# Altium project N-FPGA.PrjPcb
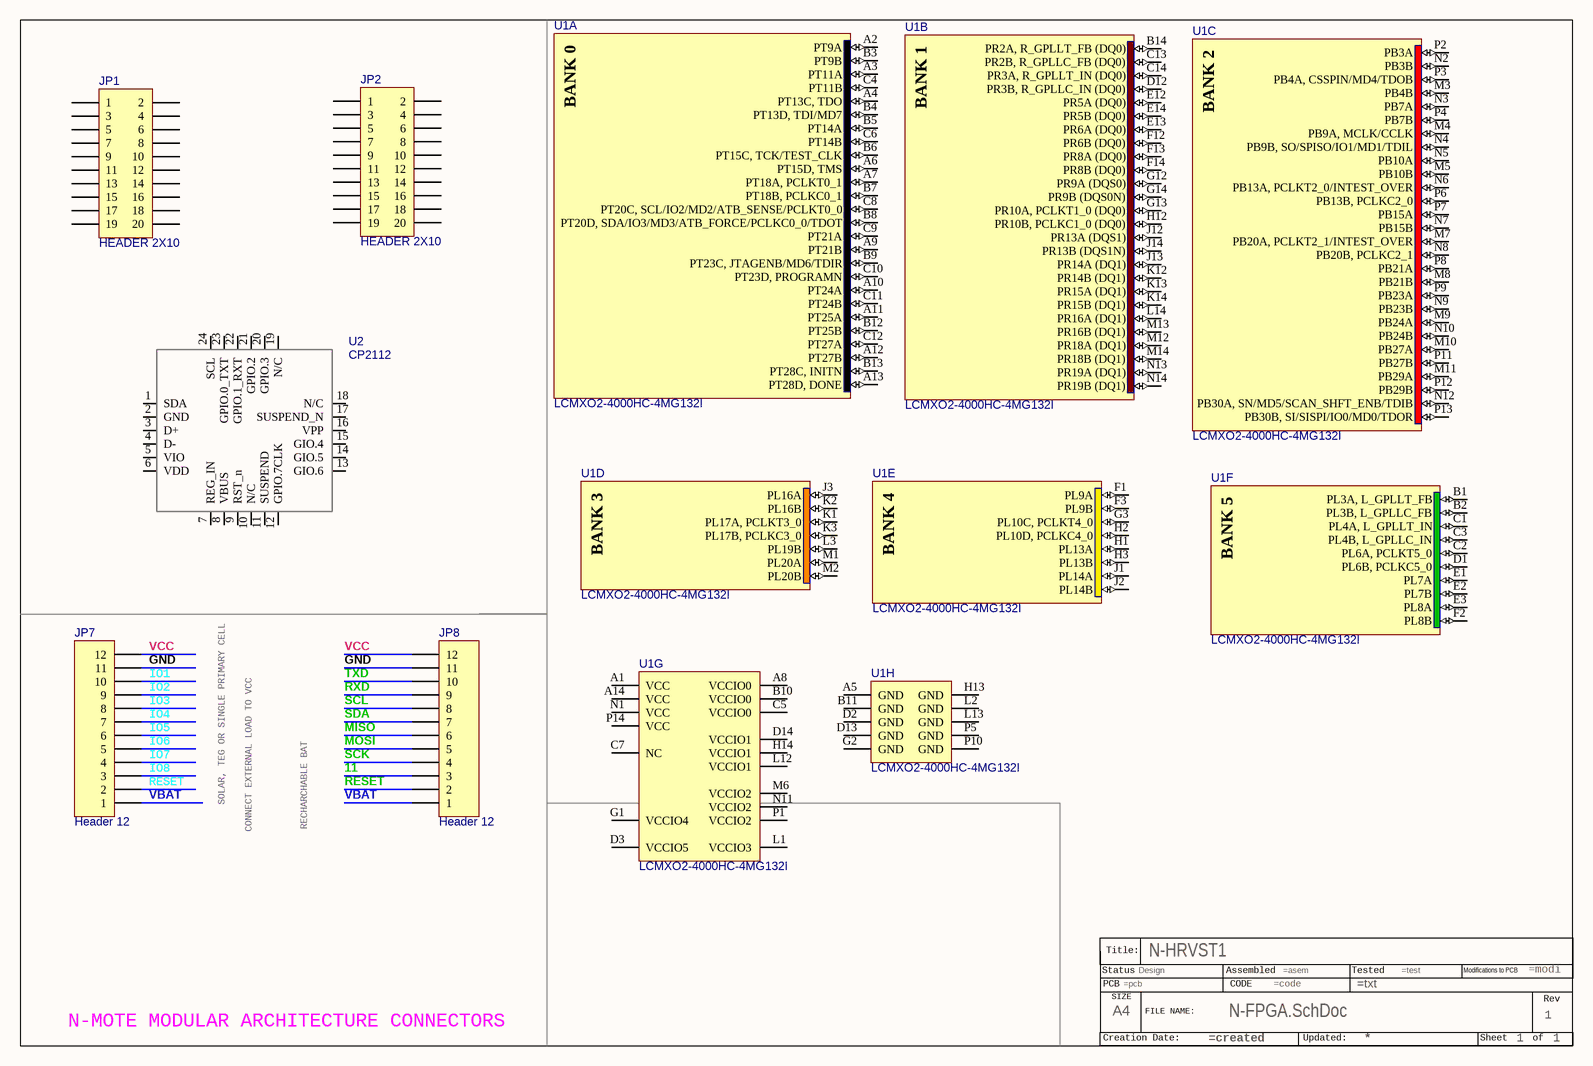
[diagram p0: N-FPGA.SchDoc]
prj: N-HRVST1; size: A4; status: Design; ver: 1
1 sheet, 7 parts. Net scope: global (net labels, ports and power ports of the same name join across sheets).
Board file: N-FPGA.PcbDoc

## Sheet N-FPGA.SchDoc
size A4; DocumentNumber: 1; SheetNumber: 1; SheetTotal: 1

### Parts
?*  FILE_NAME: N-FPGA.SchDoc  PAGE NUMPER: 1  size: A4  pr: N-HRVST1  STATUS: Design  (hidden comment: TITLEBLOCK2)  (graphical)
JP1  HEADER 2X10  [2X10]
JP2  HEADER 2X10  [2X10]
JP7  Header 12  [1X12-RIGHT]
JP8  Header 12  [1X12-RIGHT]
U1  LCMXO2-4000HC-4MG132I  [csBGA132]  (parts A,B,C,D,E,F,G,H of 8)
U2  CP2112  [QFN24]

### Nets
11: JP8.3
GND: JP7.11 JP8.11
IO1: JP7.10
IO2: JP7.9
IO3: JP7.8
IO4: JP7.7
IO5: JP7.6
IO6: JP7.5
IO7: JP7.4
IO8: JP7.3
MISO: JP8.6
MOSI: JP8.5
RESET: JP7.2 JP8.2
RXD: JP8.9
SCK: JP8.4
SCL: JP8.8
SDA: JP8.7
TXD: JP8.10
VBAT: JP7.1 JP8.1
VCC: JP7.12 JP8.12

Not connected (* = marked no-connect by the designer): ?* ?1; JP1 1 2 3 4 5 6 7 8 9 10 11 12 13 14 15 16 17 18 19 20; JP2 1 2 3 4 5 6 7 8 9 10 11 12 13 14 15 16 17 18 19 20; U1 A1(VCC) A2(PT9A) A3(PT11A) A4(PT13C,_TDO) A5(GND) A6(PT15D,_TMS) A7(PT18A,_PCLKT0_1) A8(VCCIO0) A9(PT21B) A10(PT24A) A11(PT25A) A12(PT27B) A13(PT28D,_DONE) A14(VCC) B1(PL3A,_L_GPLLT_FB) B2(PL3B,_L_GPLLC_FB) B3(PT9B) B4(PT13D,_TDI/MD7) B5(PT14A) B6(PT15C,_TCK/TEST_CLK) B7(PT18B,_PCLKC0_1) B8(PT20D,_SDA/IO3/MD3/ATB_FORCE/PCLKC0_0/TDOT) B9(PT23C,_JTAGENB/MD6/TDIR) B10(VCCIO0) B11(GND) B12(PT25B) B13(PT28C,_INITN) B14(PR2A,_R_GPLLT_FB_(DQ0)) C1(PL4A,_L_GPLLT_IN) C2(PL6A,_PCLKT5_0) C3(PL4B,_L_GPLLC_IN) C4(PT11B) C5(VCCIO0) C6(PT14B) C7(NC) C8(PT20C,_SCL/IO2/MD2/ATB_SENSE/PCLKT0_0) C9(PT21A) C10(PT23D,_PROGRAMN) C11(PT24B) C12(PT27A) C13(PR2B,_R_GPLLC_FB_(DQ0)) C14(PR3A,_R_GPLLT_IN_(DQ0)) D1(PL6B,_PCLKC5_0) D2(GND) D3(VCCIO5) D12(PR3B,_R_GPLLC_IN_(DQ0)) D13(GND) D14(VCCIO1) E1(PL7A) E2(PL7B) E3(PL8A) E12(PR5A_(DQ0)) E13(PR6A_(DQ0)) E14(PR5B_(DQ0)) F1(PL9A) F2(PL8B) F3(PL9B) F12(PR6B_(DQ0)) F13(PR8A_(DQ0)) F14(PR8B_(DQ0)) G1(VCCIO4) G2(GND) G3(PL10C,_PCLKT4_0) G12(PR9A_(DQS0)) G13(PR10A,_PCLKT1_0_(DQ0)) G14(PR9B_(DQS0N)) H1(PL13A) H2(PL10D,_PCLKC4_0) H3(PL13B) H12(PR10B,_PCLKC1_0_(DQ0)) H13(GND) H14(VCCIO1) J1(PL14A) J2(PL14B) J3(PL16A) J12(PR13A_(DQS1)) J13(PR14A_(DQ1)) J14(PR13B_(DQS1N)) K1(PL17A,_PCLKT3_0) K2(PL16B) K3(PL17B,_PCLKC3_0) K12(PR14B_(DQ1)) K13(PR15A_(DQ1)) K14(PR15B_(DQ1)) L1(VCCIO3) L2(GND) L3(PL19B) L12(VCCIO1) L13(GND) L14(PR16A_(DQ1)) M1(PL20A) M2(PL20B) M3(PB4B) M4(PB9A,_MCLK/CCLK) M5(PB10B) M6(VCCIO2) M7(PB20A,_PCLKT2_1/INTEST_OVER) M8(PB21B) M9(PB24A) M10(PB27A) M11(PB29A) M12(PR18A_(DQ1)) M13(PR16B_(DQ1)) M14(PR18B_(DQ1)) N1(VCC) N2(PB3B) N3(PB7A) N4(PB9B,_SO/SPISO/IO1/MD1/TDIL) N5(PB10A) N6(PB13A,_PCLKT2_0/INTEST_OVER) N7(PB15B) N8(PB20B,_PCLKC2_1) N9(PB23B) N10(PB24B) N11(VCCIO2) N12(PB30A,_SN/MD5/SCAN_SHFT_ENB/TDIB) N13(PR19A_(DQ1)) N14(PR19B_(DQ1)) P1(VCCIO2) P2(PB3A) P3(PB4A,_CSSPIN/MD4/TDOB) P4(PB7B) P5(GND) P6(PB13B,_PCLKC2_0) P7(PB15A) P8(PB21A) P9(PB23A) P10(GND) P11(PB27B) P12(PB29B) P13(PB30B,_SI/SISPI/IO0/MD0/TDOR) P14(VCC); U2 1(SDA) 2(GND) 3(D+) 4(D-) 5(VIO) 6(VDD) 7(REG_IN) 8(VBUS) 9(RST_n) 10(N/C) 11(SUSPEND) 12(GPIO.7CLK) 13(GIO.6) 14(GIO.5) 15(GIO.4) 16(VPP) 17(SUSPEND_N) 18(N/C) 19(N/C) 20(GPIO.3) 21(GPIO.2) 22(GPIO.1_RXT) 23(GPIO.0_TXT) 24(SCL)

### Notes on the sheet
- SOLAR, TEG OR SINGLE PRIMARY CELL
- CONNECT EXTERNAL LOAD TO VCC
- RECHARCHABLE BAT
- N-MOTE MODULAR ARCHITECTURE CONNECTORS
- (in symbol LCMXO2-4000HC-4MG132I, part A) BANK 0
- (in symbol LCMXO2-4000HC-4MG132I, part B) BANK 1
- (in symbol LCMXO2-4000HC-4MG132I, part C) BANK 2
- (in symbol LCMXO2-4000HC-4MG132I, part D) BANK 3
- (in symbol LCMXO2-4000HC-4MG132I, part E) BANK 4
- (in symbol LCMXO2-4000HC-4MG132I, part F) BANK 5
- (in symbol TITLEBLOCK2) Title:; Status; Assembled; Tested; Modifications to PCB; PCB; CODE; SIZE; Rev; FILE NAME:; Creation Date:; Updated:; Sheet; of

### Library data of the parts
JP1 JP2 = Header 10X2: Header, 7-Pin, Dual row; Manufacturer: Generic Components; Class I: Connector; Revision: July-2002: Re-released for DXP Platform.; Publisher: Altium Limited
JP7 JP8 = Header 12: Header, 12 PIN; Revision: 17-Jul-2002: Re-released for DXP Platform.; FARNELL: 9733507
U1 = LCMXO2-4000HC-4MG132I: MachXO2 High Performance CPLD with 4320 LUTs, Voltage Regulator, 2.5V/3.3V, 132-pin csBGA, Speed Grade-4, Industrial Grade, Halogen Free (RoHS); DatasheetVersion: ver01.5, Aug-2011; PackageVersion: ver02.8, Jul-2011; PackageReference: csBGA132; PackageDescription: 132-Ball Chip Scale Ball Grid Array (csBGA132); ComponentLink1Description: Manufacturer URL; ComponentLink1URL: http://www.latticesemi.com/; ComponentLink2Description: Datasheet; ComponentLink2URL: http://www.latticesemi.com/documents/DS1035.pdf; ComponentLink3Description: Package Specification; ComponentLink3URL: http://www.latticesemi.com/lit/docs/package/pkg.pdf
?* = TITLEBLOCK2: CREATION DATE: =created; UPDATED: *; PAGE COUNT: 1; VERSION: 1; ASSEMBLY: =asem; MODIFICATIONS TO OPERATE: =modi; TESTED: =test; PCB: =pcb; CODE: =code; TEXT: =txt